# EasyEDA schematic SCH_Balun-(SMD,-ENCLOSURE)_2026-03-13.json
TITLE: Balun (SMD, ENCLOSURE): Main module; REV: 1.0.EE; Date: 2021-02-24; Sheet: 1/1; Drawn By: IgrikXD; Company: Easy-SDR
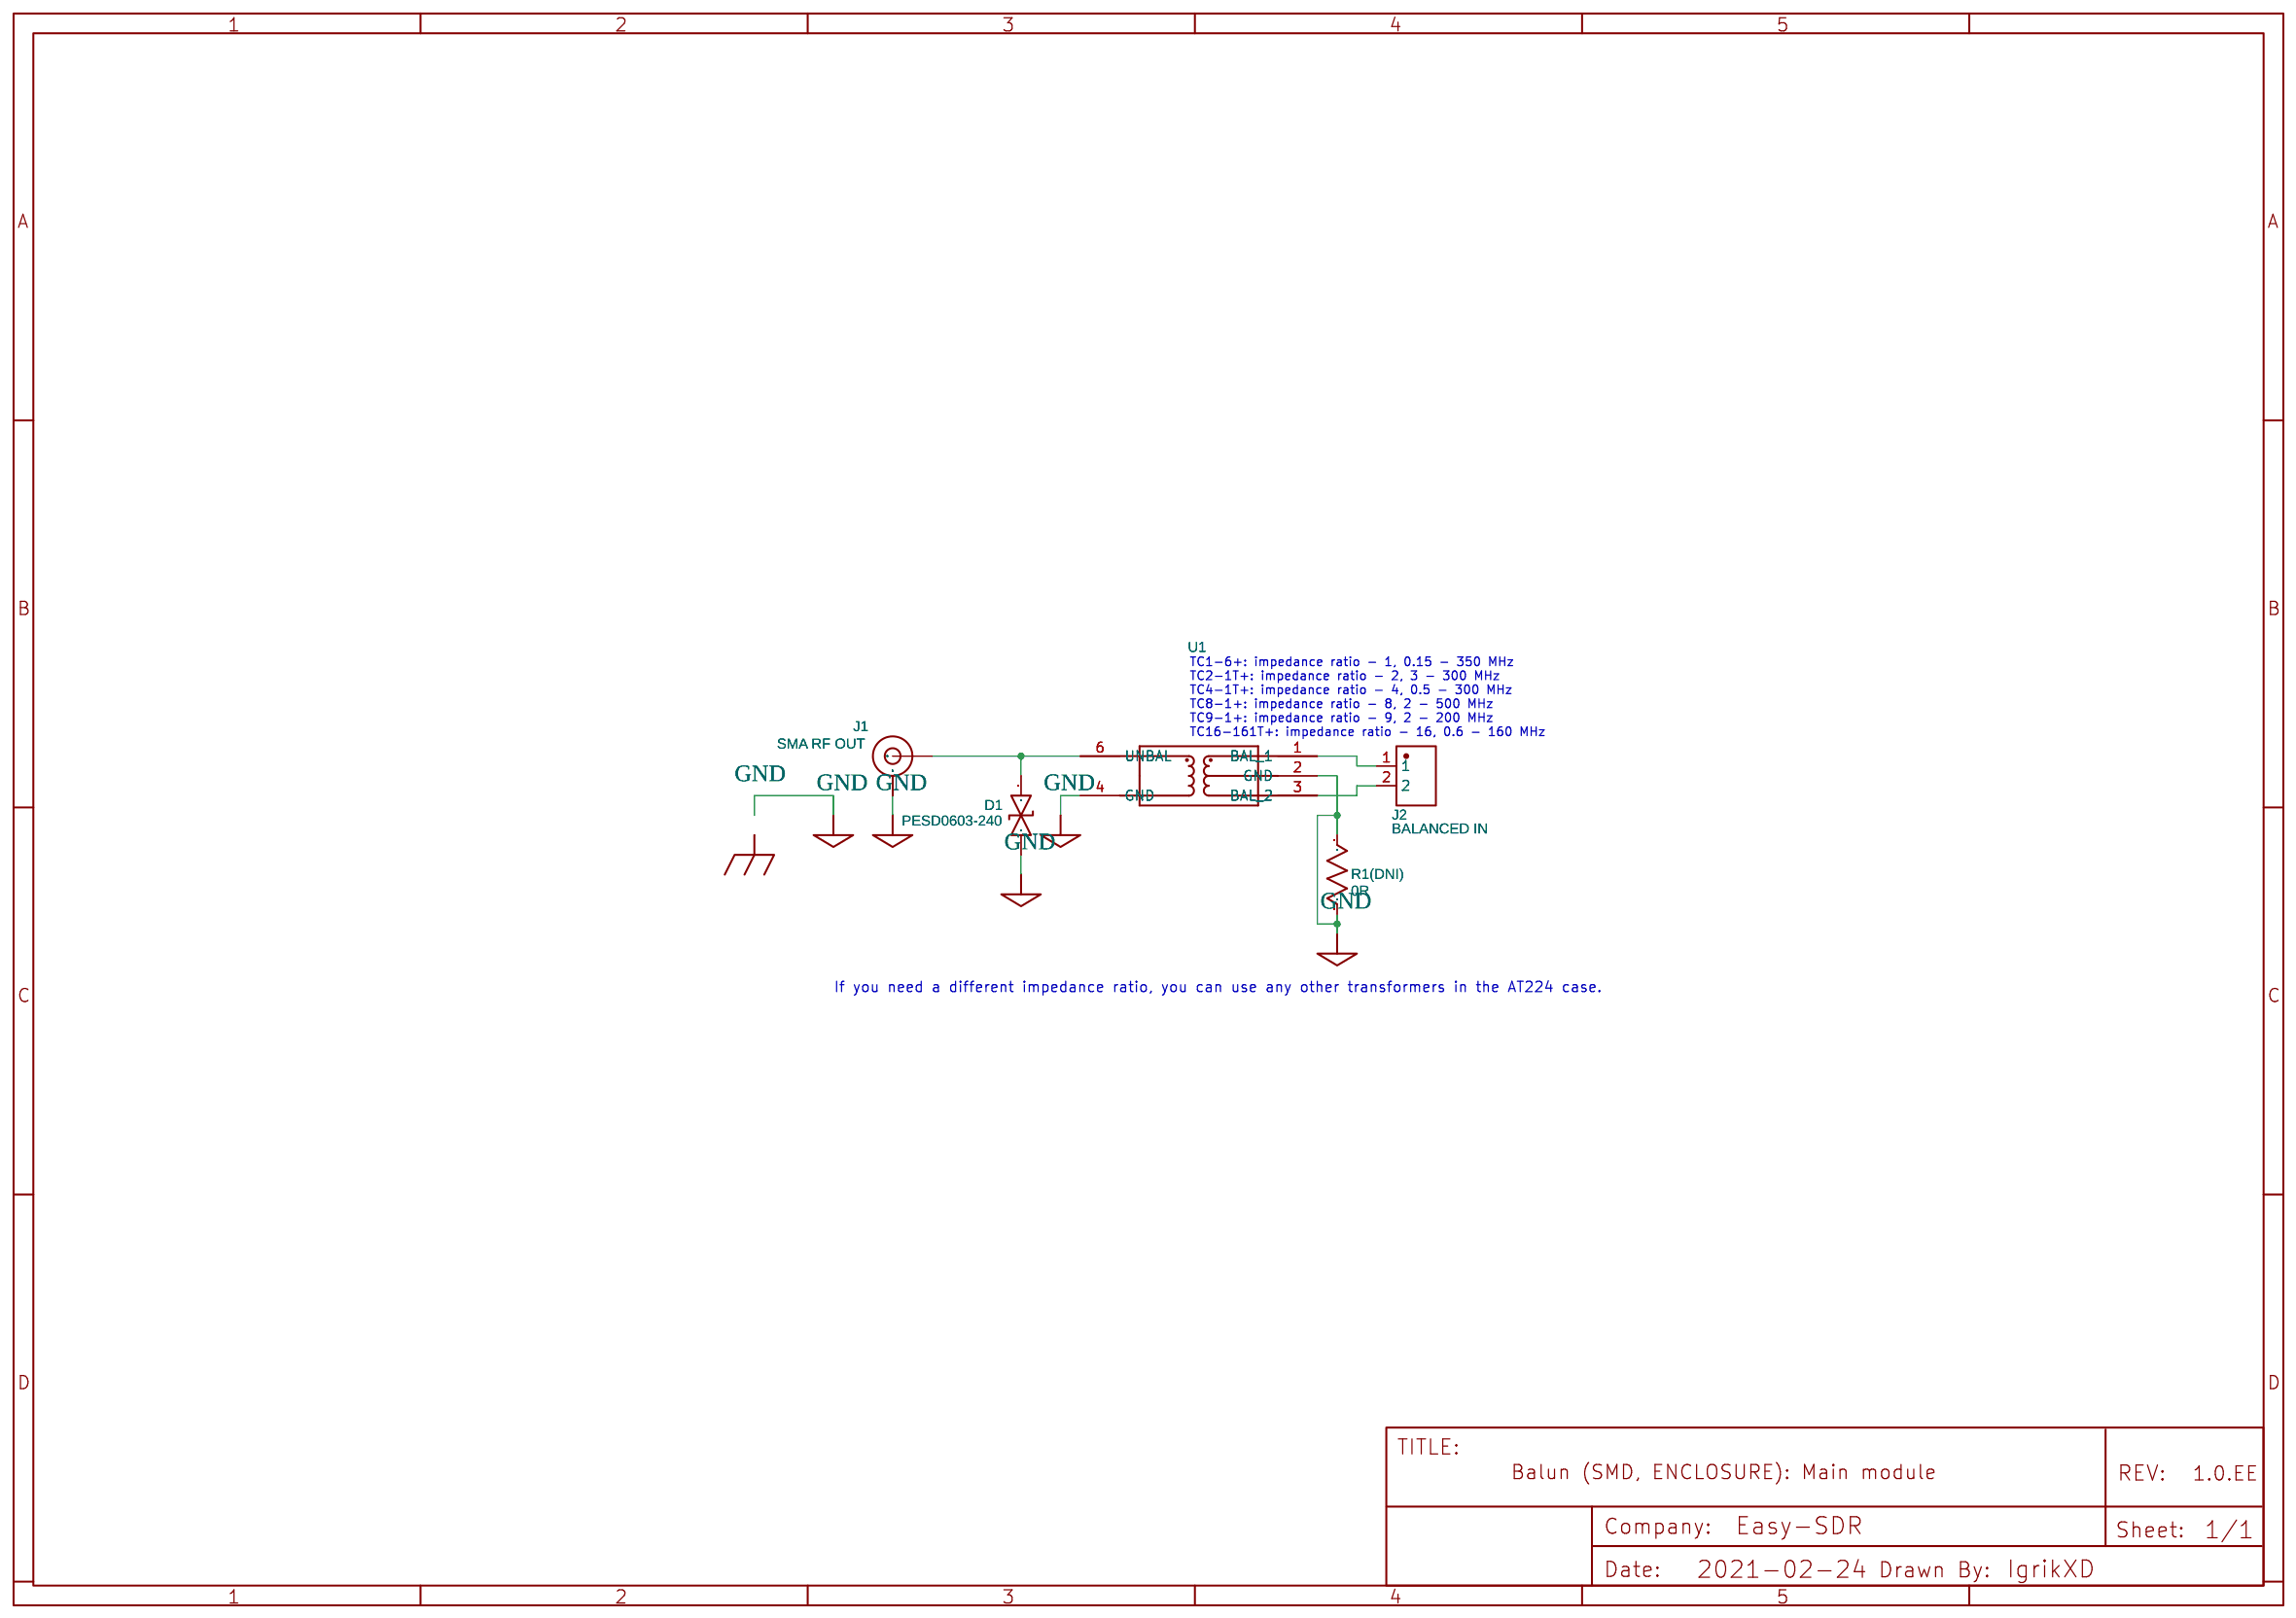
[diagram p0: schematic sheet]

## Parts
D1  PESD0603-240  [0603]
J1  SMA RF OUT  [SMA-TH]
J2  BALANCED IN  [CONN-TH_2P-P5.08_XY2500R-D5.08-2P]
R1(DNI)  0R  [0805]
U1  TC9-1+  [AT224-1A]

## Library data of the parts
D1 = PESD0603-240: Supplier: LCSC; Manufacturer: TE Connectivity; Contributor: LCSC; Supplier Part: C10659
J1 = -: Contributor: IgrikXD; Manufacturer Part: KH-SMA-KWE17-G; Supplier: LCSC; Supplier Part: C530662; Manufacturer: Shenzhen Kinghelm Elec
J2 = XY2500R-D-5.08-2P: Supplier: LCSC; Supplier Part: C505824; Manufacturer: Ningbo Xinlaiya Elec.; Contributor: LCSC
R1(DNI) = Resistor: Manufacturer Part: RTT051000FTP; Supplier: LCSC; Manufacturer: RALEC; Supplier Part: C103902
U1 = TC9-1+: Contributor: IgrikXD; Supplier: Mini-Circuits; Manufacturer: Mini-Circuits; link: https://www.minicircuits.com/WebStore/dashboard.html?model=TC9-1%2B

## Nets
GND: D1.1 J1.1(GND) J1.2(GND) J1.3(GND) J1.4(GND) R1(DNI).1 R1(DNI).2 U1.2(GND) U1.4(GND)
Net-(D1-2): D1.2 J1.5(SIGNAL) U1.6(UNBAL)
Net-(J2-1): J2.1 U1.1(BAL 1)
Net-(J2-2): J2.2 U1.3(BAL 2)

## Notes on the sheet
- TC1-6+: impedance ratio - 1, 0.15 - 350 MHz
  TC2-1T+: impedance ratio - 2, 3 - 300 MHz
  TC4-1T+: impedance ratio - 4, 0.5 - 300 MHz
  TC8-1+: impedance ratio - 8, 2 - 500 MHz
  TC9-1+: impedance ratio - 9, 2 - 200 MHz
  TC16-161T+: impedance ratio - 16, 0.6 - 160 MHz
- If you need a different impedance ratio, you can use any other transformers in the AT224 case.
